# EAGLE design Freezer-Monitor-v2-PCB (EAGLE 9.4.0)
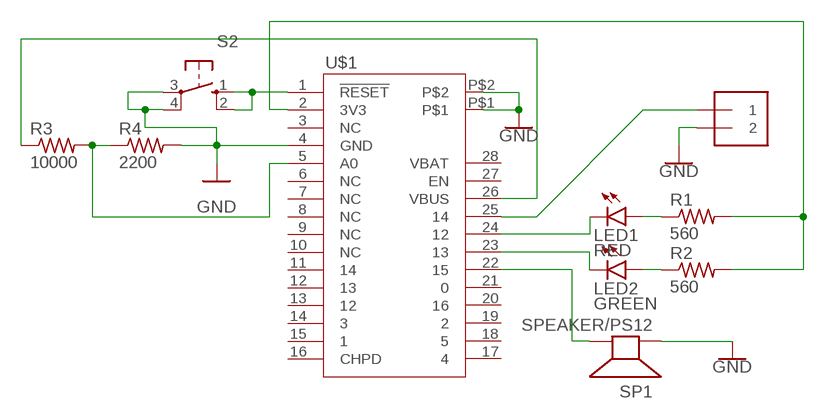
[diagram p0: schematic, sheet 1]

## Parts
J1  1X2-3.5MM  [1X2-3.5MM]
LED1  RED  LED10MM  [LED10MM]
LED2  GREEN  LED10MM  [LED10MM]
R1  560  R-US_0207/9  [0207/9]
R2  560  R-US_0207/9  [0207/9]
R3  10000  R-US_0207/9  [0207/9]
R4  2200  R-US_0207/9  [0207/9]
S2  10-XX  [B3F-10XX]
SP1  SPEAKER/PS12  [PS12]
U$1  FEATHER_ESP8266_HUZZAHFEATHER_HUZZAH  [FEATHER]

## Nets
GND: J1.2 R4.2 S2.3(P) S2.4(P1) SP1.P$1(+) U$1.4(GND) U$1.P$1 U$1.P$2
N$1: R1.2 R2.2 U$1.2(3V3)
N$2: LED1.A R1.1
N$3: LED2.A R2.1
N$4: LED1.K(C) U$1.24
N$5: LED2.K(C) U$1.23
N$6: J1.1 U$1.25
N$7: SP1.P$2(-) U$1.22
N$8: R3.2 R4.1 U$1.5(A0)
N$9: R3.1 U$1.26(VBUS)
N$11: S2.1(S) S2.2(S1) U$1.1(!RESET)
Unconnected: U$1.3(NC) U$1.6(NC) U$1.7(NC) U$1.8(NC) U$1.9(NC) U$1.10(NC) U$1.11 U$1.12 U$1.13 U$1.14 U$1.15 U$1.16(CHPD) U$1.17 U$1.18 U$1.19 U$1.20 U$1.21 U$1.27(EN)

## Power pins joined to a net without a drawn wire
VBAT: U$1.28(VBAT)

## Library data of the parts
J1 = adafruit:1X2: 3.5mm Terminal block http://www.ladyada.net/library/pcb/eaglelibrary.html
LED1 LED2 = led:LED: LED OSRAM: - CHIPLED LG R971, LG N971, LY N971, LG Q971, LY Q971, LO R971, LY R971 LH N974, LH R974 LS Q976, LO Q976, LY Q976 LO Q996 - Hyper CHIPLED LW Q18S LB Q993, LB Q99A, LB R99A - SideLED LS A670, LO A670, LY A670, LG A670, LP A670 LB A673, LV A673, LT A673, LW A673 LH A674 LY A675 LS A676, LA A676, LO A676, LY A676, LW A676 LS A679, LY A679, LG A679 - Hyper Micro SIDELED® LS Y876, LA Y876, LO Y876, LY Y876 LT Y87S - SmartLED LW L88C, LW L88S LB L89C, LB L89S, LG L890 LS L89K, LO L89K, LY L89K LS L896, LA L896, LO L896, LY L896 - TOPLED LS T670, LO T670, LY T670, LG T670, LP T670 LSG T670, LSP T670, LSY T670, LOP T670, LYG T670 LG T671, LOG T671, LSG T671 LB T673, LV T673, LT T673, LW T673 LH T674 LS T676, LA T676, LO T676, LY T676, LB T676, LH T676, LSB T676, LW T676 LB T67C, LV T67C, LT T67C, LS T67K, LO T67K, LY T67K, LW E67C LS E67B, LA E67B, LO E67B, LY E67B, LB E67C, LV E67C, LT E67C LW T67C LS T679, LY T679, LG T679 LS T770, LO T770, LY T770, LG T770, LP T770 LB T773, LV T773, LT T773, LW T773 LH T774 LS E675, LA E675, LY E675, LS T675 LS T776, LA T776, LO T776, LY T776, LB T776 LHGB T686 LT T68C, LB T68C - Hyper Mini TOPLED® LB M676 - Mini TOPLED Santana® LG M470 LS M47K, LO M47K, LY M47K Source: http://www.osram.convergy.de LUXEON: - LUMILED® LXK2-PW12-R00, LXK2-PW12-S00, LXK2-PW14-U00, LXK2-PW14-V00 LXK2-PM12-R00, LXK2-PM12-S00, LXK2-PM14-U00 LXK2-PE12-Q00, LXK2-PE12-R00, LXK2-PE12-S00, LXK2-PE14-T00, LXK2-PE14-U00 LXK2-PB12-K00, LXK2-PB12-L00, LXK2-PB12-M00, LXK2-PB14-N00, LXK2-PB14-P00, LXK2-PB14-Q00 LXK2-PR12-L00, LXK2-PR12-M00, LXK2-PR14-Q00, LXK2-PR14-R00 LXK2-PD12-Q00, LXK2-PD12-R00, LXK2-PD12-S00 LXK2-PH12-R00, LXK2-PH12-S00 LXK2-PL12-P00, LXK2-PL12-Q00, LXK2-PL12-R00 Source: www.luxeon.com KINGBRIGHT: KA-3528ASYC Source: www.kingbright.com
R1-R4 = adafruit:R-US_: RESISTOR, American symbol
S2 = switch-omron:10-XX: OMRON SWITCH; MPN: B3F-1000; OC_FARNELL: 176432; OC_NEWARK: 36M3542
SP1 = adafruit:SPEAKER: SPEAKER Source: Buerklin Added PS12 (for part # PS1240 piezo) http://www.ladyada.net/library/pcb/eaglelibrary.html
U$1 = ludwig:FEATHER_ESP8266_HUZZAH

## Board
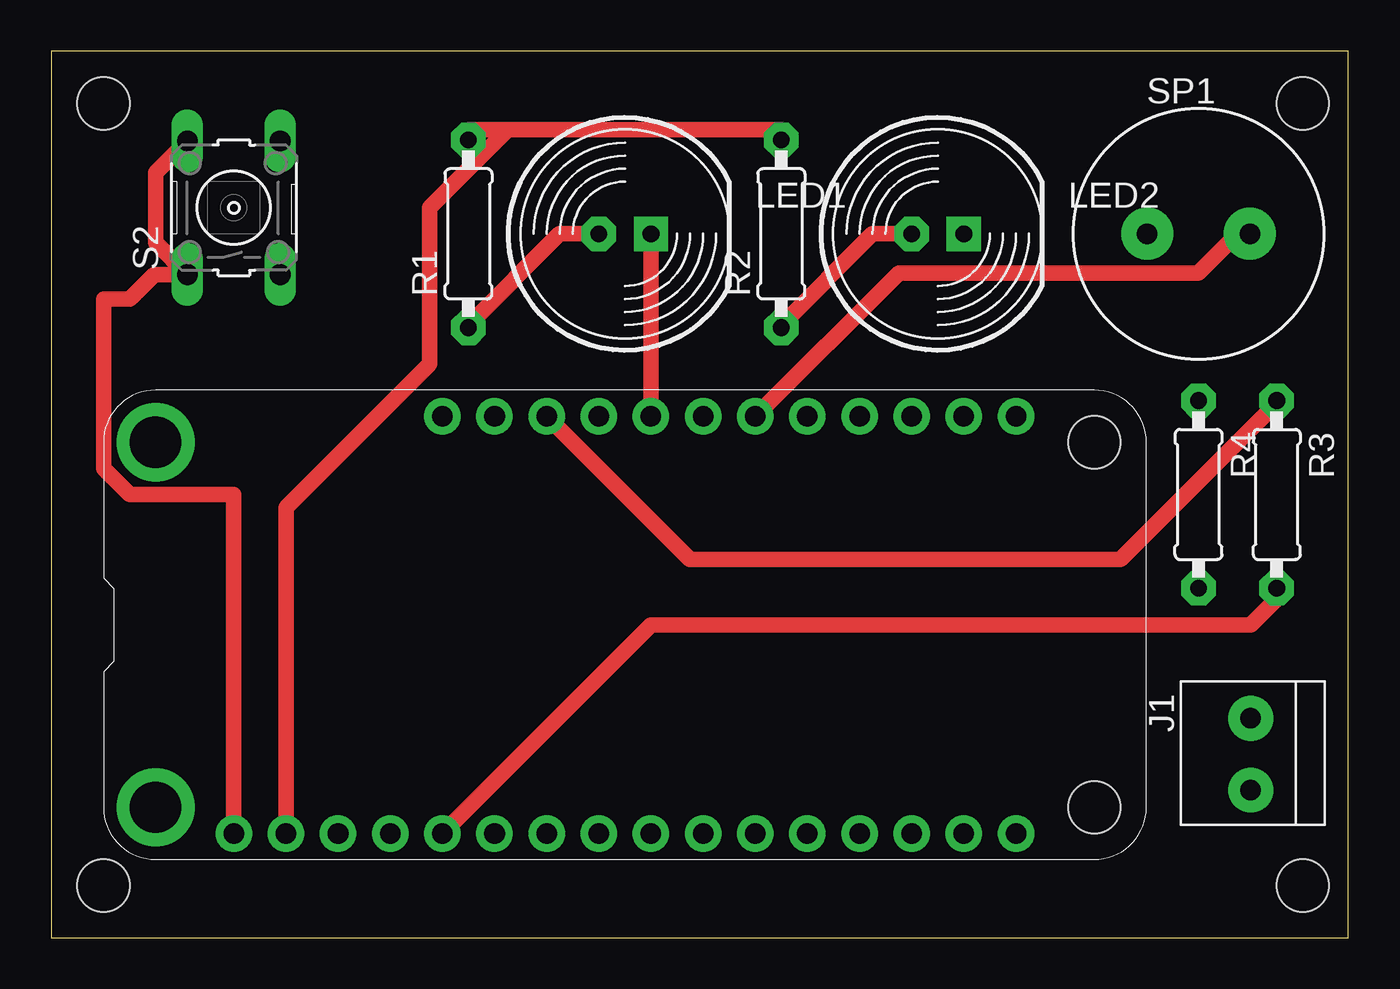
[diagram p1: board, top side]
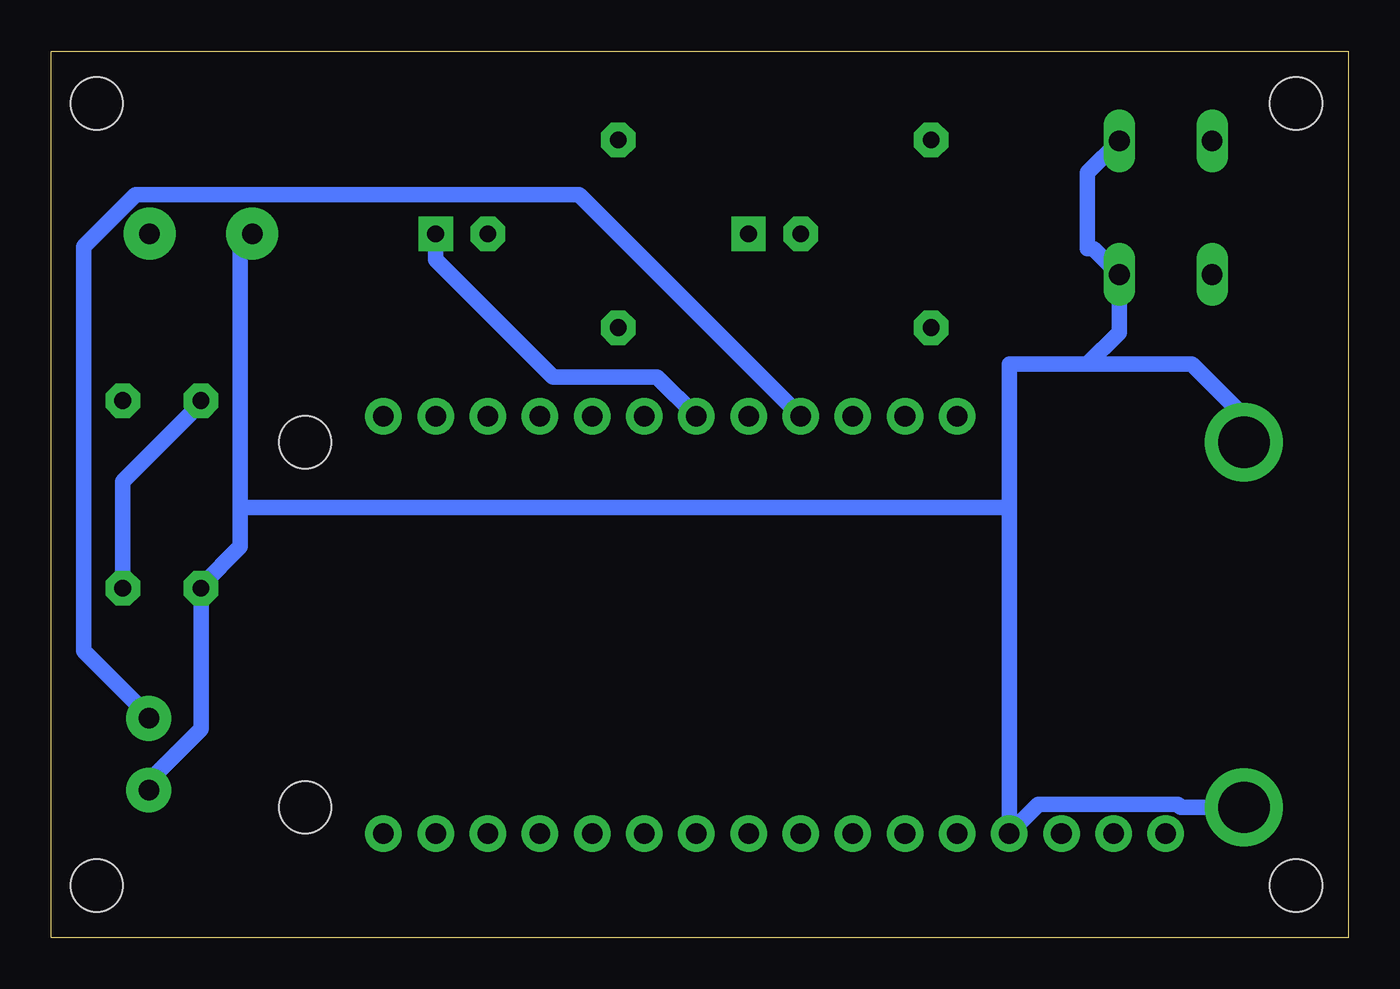
[diagram p2: board, bottom side, seen from below]

Size 63.17 x 43.18 mm. Coordinates in mm from the lower left corner, seen from the top.
Outline: 0,0 63.17,0 63.17,43.18 0,43.18 0,0
Copper layers (1*16): Top 0.035mm / dielectric 1.5mm / Bottom 0.035mm
Design rules "default *": minimum track width 0.75mm, minimum drill 0.35mm, track to track 6mil, track to pad 6mil, pad to pad 6mil, via to via 6mil, smd to smd 6mil, copper to edge 40mil, drill to drill 6mil, minimum pad ring 10mil, minimum via ring 8mil, stop-mask expansion 4mil, vias tented up to drill 0mil, thermal gap 10mil
Holes 2.54 mm at 2.54,40.64 60.96,40.64 2.54,2.54 60.96,2.54

### Footprints (pad centres in the part's own frame; a part is rotated, then mirrored left to right if it is on the bottom)
1X2-3.5MM = drill 1 pad 2.184: 1 1.8,0; 2 -1.7,0
LED10MM = drill 0.813 pad 1.676 octagon: A -1.27,0 | drill 0.813 pad 1.676 square: K 1.27,0
0207/9 = drill 0.813 pad 1.676 octagon: 1 -4.572,0; 2 4.572,0
B3F-10XX = drill 1.016 long: 1 -3.251,2.261; 2 3.251,2.261; 3 -3.251,-2.261; 4 3.251,-2.261
PS12 = drill 1 pad 2.54: P$1 -2.5,0; P$2 2.5,0
FEATHER = drill 1 pad 1.778: 1 3.81,-1.27; 2 6.35,-1.27; 3 8.89,-1.27; 4 11.43,-1.27; 5 13.97,-1.27; 6 16.51,-1.27; 7 19.05,-1.27; 8 21.59,-1.27; 9 24.13,-1.27; 10 26.67,-1.27; 11 29.21,-1.27; 12 31.75,-1.27; 13 34.29,-1.27; 14 36.83,-1.27; 15 39.37,-1.27; 16 41.91,-1.27; 17 41.91,19.05; 18 39.37,19.05; 19 36.83,19.05; 20 34.29,19.05; 21 31.75,19.05; 22 29.21,19.05; 23 26.67,19.05; 24 24.13,19.05; 25 21.59,19.05; 26 19.05,19.05; 27 16.51,19.05; 28 13.97,19.05 | drill 2.5 pad 3.81: P$1 0,17.78; P$2 0,0 | hole 2.54: 45.72,17.78; 45.72,0

### Placement (x,y rotation side)
J1  58.42,8.89 90 top
LED1  27.94,34.29 0 top
LED2  43.18,34.29 0 top
R1  20.32,34.29 90 top
R2  35.56,34.29 90 top
R3  59.69,21.59 270 top
R4  55.88,21.59 270 top
S2  8.89,35.56 90 top
SP1  55.88,34.29 0 top
U$1  5.08,6.35 0 top

### Tracks (layer width: path | path; a pad name or v marks a point on that pad's centre or on a via)
GND
  Bottom 0.75: J1.2 58.42,7.62 55.88,10.16 R4.2 55.88,17.14 53.98,19.05 53.98,20.95 | 53.98,20.95 53.98,34.29 SP1.P$1 | 16.51,20.95 16.51,27.94 12.7,27.94 | 16.51,20.95 U$1.4 15.09,6.5 8.3,6.5 8.16,6.35 U$1.P$2 | 12.7,27.94 7.62,27.94 5.08,25.4 U$1.P$1 | 16.51,20.95 53.98,20.95 | 12.7,27.94 11.15,29.49 S2.3 12.42,33.58 12.7,33.58 12.7,37.26 S2.4
N$1
  Top 0.75: 22.23,39.37 35.56,39.37 R2.2 | 22.23,39.37 20.32,39.37 R1.2 | U$1.2 11.43,20.95 18.41,27.94 18.41,35.56 22.23,39.37
N$2
  Top 0.75: LED1.A 24.77,34.29 20.32,29.84 R1.1
N$3
  Top 0.75: LED2.A 40.01,34.29 35.56,29.84 R2.1
N$4
  Top 0.75: U$1.24 LED1.K
N$5
  Bottom 0.75: LED2.K 44.45,33.02 38.73,27.3 33.66,27.3 U$1.23
N$6
  Bottom 0.75: U$1.25 37.47,36.2 59.05,36.2 61.59,33.66 61.59,13.97 58.42,10.79 J1.1
N$7
  Top 0.75: U$1.22 41.27,32.38 55.88,32.38 57.78,34.29 SP1.P$2
N$8
  Top 0.75: U$1.5 29.21,15.24 58.42,15.24 59.69,16.51 R3.2
  Bottom 0.75: R3.2 59.69,22.23 55.88,26.04 R4.1
N$9
  Top 0.75: U$1.26 31.11,18.41 52.07,18.41 59.69,26.04 R3.1
N$11
  Top 0.75: U$1.1 8.89,21.59 3.81,21.59 2.54,22.86 2.54,31.11 3.81,31.11 5,32.31 S2.1 | S2.1 6.35,32.59 | S2.2 5.08,37.26 5.08,33.86 S2.1